# EAGLE design LD_v1 (EAGLE 7.1.0)
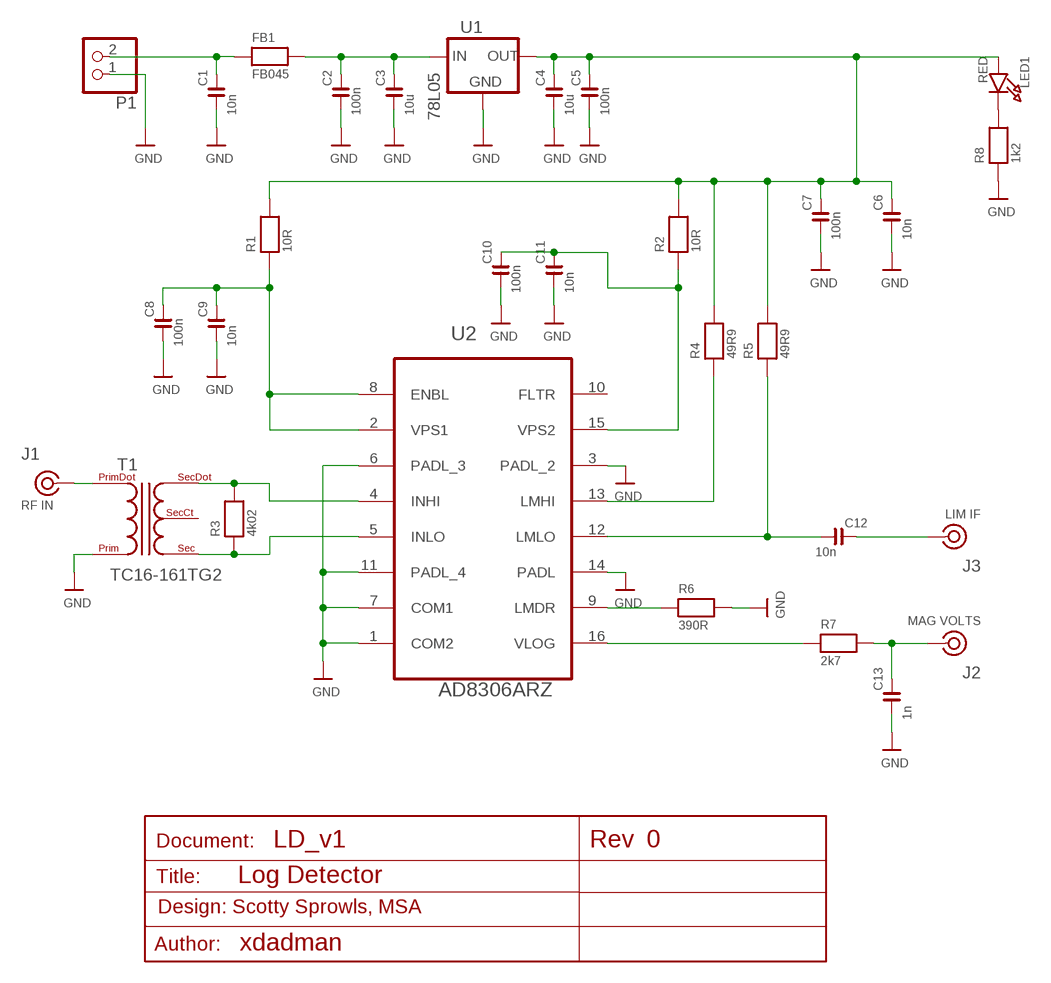
[diagram p0: schematic, sheet 1]

## Parts
C1  10n  C080510N  [C0805]
C2  100n  C0805100N  [C0805]
C3  10u  CC120610U  [C1206]
C4  10u  CC120610U  [C1206]
C5  100n  C0805100N  [C0805]
C6  10n  C080510N  [C0805]
C7  100n  C0805100N  [C0805]
C8  100n  C0805100N  [C0805]
C9  10n  C080510N  [C0805]
C10  100n  C0805100N  [C0805]
C11  10n  C080510N  [C0805]
C12  10n  C080510N  [C0805]
C13  1n  C08051N  [C0805]
FB1  FB045  R0805FB045  [R0805]
J1  RF IN  COAX  [SLIM_COAX_PAD]
J2  MAG VOLTS  COAX  [SLIM_COAX_PAD]
J3  LIM IF  COAX  [SLIM_COAX_PAD]
LED1  RED  LED_0603_RED0603  [CHIPLED_0603]
P1  PINHD-1X2  [1X02]
R1  10R  R080510R  [R0805]
R2  10R  R080510R  [R0805]
R3  4k02  R08054K02  [R0805]
R4  49R9  R080549R9  [R0805]
R5  49R9  R080549R9  [R0805]
R6  390R  R0805390R  [R0805]
R7  2k7  R08052K7  [R0805]
R8  1k2  R08051K2  [R0805]
T1  TC16-161TG2  [TC16-161TG2]
U1  78L05  78MXXL78L05  [SOT89]
U2  AD8306ARZ  [SOIC16]

## Nets
+5V: C4.2 C5.2 C6.2 C7.2 LED1.A R1.2 R2.2 R4.2 R5.2 U1.1(OUT)
+10V: C1.2 FB1.1 P1.2
GND: C1.1 C2.1 C3.1 C4.1 C5.1 C6.1 C7.1 C8.1 C9.1 C10.1 C11.1 C13.1 P1.1 R6.2 R8.1 T1.4 U1.2(GND) U1.4(GND) U2.1(COM2) U2.3(PADL_2) U2.6(PADL_3) U2.7(COM1) U2.11(PADL_4) U2.14(PADL)
N$1: C2.2 C3.2 FB1.2 U1.3(IN)
N$2: C8.2 C9.2 R1.1 U2.2(VPS1) U2.8(ENBL)
N$3: R4.1 U2.13(LMHI)
N$4: C13.2 J2.SIG R7.2
N$5: C12.1 R5.1 U2.12(LMLO)
N$6: C12.2 J3.SIG
N$7: R3.2 T1.1 U2.4(INHI)
N$8: R3.1 T1.3 U2.5(INLO)
N$9: J1.SIG T1.6
N$10: R6.1 U2.9(LMDR)
N$11: R7.1 U2.16(VLOG)
N$12: LED1.C R8.2
N$13: C10.2 C11.2 R2.1 U2.15(VPS2)
Unconnected: T1.2 U2.10(FLTR)

## Notes on the sheet
- 0
- Log Detector
- Design: Scotty Sprowls, MSA
- xdadman

## Power pins joined to a net without a drawn wire
GND: J1.GND J2.GND J3.GND

## Library data of the parts
C1 C6 C9 C11 C12 = MSA_lib:C0805: Ceramic capacitor; OC_FARNELL: 1414662
C2 C5 C7 C8 C10 = MSA_lib:C0805: Ceramic capacitor; OC_FARNELL: 1759166
C3 C4 = MSA_lib:CC1206: Capacitor ceramic 1206; OC_FARNELL: 1611967
C13 = MSA_lib:C0805: Ceramic capacitor; OC_FARNELL: 1833879
FB1 = MSA_lib:R0805: Resistors; OC_FARNELL: 1515661
J1-J3 = MSA_lib:COAX
LED1 = MSA_lib:LED_0603_RED: Chip LED 0603 RED 2ma; OC_FARNELL: 1685068
P1 = MSA_lib:PINHD-1X2: PIN HEADER
R1 R2 = MSA_lib:R0805: Resistors; OC_FARNELL: 2332043
R3 = MSA_lib:R0805: Resistors; OC_FARNELL: 2141823
R4 R5 = MSA_lib:R0805: Resistors; OC_FARNELL: 2312274
R6 = MSA_lib:R0805: Resistors; OC_FARNELL: 1500711
R7 = MSA_lib:R0805: Resistors; OC_FARNELL: 2332077
R8 = MSA_lib:R0805: Resistors; OC_FARNELL: 9333827
T1 = MSA_lib:TC16-161TG2: Minicirquits transformer; VENDOR: minicirquits
U1 = MSA_lib:78MXXL: VOLTAGE REGULATOR; OC_FARNELL: 1366573
U2 = MSA_lib:AD8306ARZ: High Precision Limiting-Logarithmic Amplifier; MPN: AD8306ARZ; OC_FARNELL: 1814350; OC_NEWARK: 59K6558; PACKAGE: SOIC-16; SUPPLIER: Analog Devices

## Board

Size 32 x 32 mm. Coordinates in mm from the lower left corner, seen from the top.
Outline: 0,0 32,0 32,32 0,32 0,0
Copper layers (1*16): Top 0.035mm / dielectric 1.5mm / Bottom 0.035mm
Design rules "kuba_no_CLR": minimum track width 8mil, minimum drill 15mil, track to track 8mil, track to pad 8mil, pad to pad 8mil, via to via 8mil, smd to smd 8mil, copper to edge 0mil, drill to drill 8mil, minimum pad ring 12mil, minimum via ring 10mil, stop-mask expansion 4mil, vias tented up to drill 0mil, thermal gap 10mil

### Footprints (pad centres in the part's own frame; a part is rotated, then mirrored left to right if it is on the bottom)
C0805 = smd 1.2 x 1.5: 1 -0.953,0; 2 0.953,0
C1206 = smd 1.6 x 1.8: 1 -1.4,0; 2 1.4,0
R0805 = smd 1.3 x 1.5: 1 -0.95,0; 2 0.95,0
SLIM_COAX_PAD = smd 1.27 x 0.635 bottom: GND 0,-2.667 | drill 1.1: SIG 0,0
CHIPLED_0603 = smd 0.8 x 0.8: A 0,-0.75; C 0,0.75
1X02 = drill 1.016: 1 -1.27,0; 2 1.27,0
TC16-161TG2 = smd 0.76 x 1.65: 1 -1.27,1.6; 2 0,1.6; 3 1.27,1.6; 4 1.27,-1.6; 6 -1.27,-1.6
SOT89 = smd 1.2 x 1.5: 1 -1.6,-2; 3 1.6,-2 | smd 1 x 1.5: 2 0,-2 | smd 2.4 x 3: 4 0,1.25
SOIC16 = smd 1.981 x 0.559: 1 -2.464,4.445; 2 -2.464,3.175; 3 -2.464,1.905; 4 -2.464,0.635; 5 -2.464,-0.635; 6 -2.464,-1.905; 7 -2.464,-3.175; 8 -2.464,-4.445; 9 2.464,-4.445; 10 2.464,-3.175; 11 2.464,-1.905; 12 2.464,-0.635; 13 2.464,0.635; 14 2.464,1.905; 15 2.464,3.175; 16 2.464,4.445

### Placement (x,y rotation side)
C1  4.32,4.83 90 top
C2  12.19,8.89 180 top
C3  9.91,5.08 90 top
C4  19.81,4.83 90 top
C5  17.27,4.32 90 top
C6  27.18,16.76 180 top
C7  27.18,14.48 180 top
C8  10.67,11.94 270 top
C9  10.67,20.07 270 top
C10  24.89,19.81 270 top
C11  22.61,19.81 270 top
C12  22.61,10.67 270 top
C13  22.61,23.62 90 top
FB1  5.08,8.64 0 top
J1  6.35,25.65 180 top
J2  25.4,25.65 180 top
J3  25.4,8.38 90 top
LED1  23.88,5.08 270 top
P1  7.11,4.83 90 top
R1  15.24,8.64 270 top
R2  17.53,8.64 270 top
R3  10.67,16 90 top
R4  23.37,16.76 0 top
R5  23.37,14.48 0 top
R6  19.81,9.4 270 top
R7  19.05,23.62 90 top
R8  26.16,4.06 90 top
T1  6.1,16 270 top
U1  13.72,4.83 180 top
U2  16.51,16 0 top

### Tracks (layer width: path | path; a pad name or v marks a point on that pad's centre or on a via)
+5V
  Top 0.406: LED1.A 23.13,6.21 23.11,6.23
  Top 0.61: R4.2 C6.2 C7.2 | R5.2 C7.2 | C4.2 23.11,6.23 26.67,6.23 26.67,6.35 27.94,7.62 27.94,11.68 26.67,12.95 26.67,14.03 C7.2
  Top 1.016: R1.2 15.24,6.9 U1.1 15.32,7.69 R2.2 17.53,6.6 | 17.53,6.6 17.53,5.52 C5.2 | C4.2 17.9,6.23 17.53,6.6
+10V
  Top 0.813: P1.2 4.32,6.1 C1.2 4.13,5.78 FB1.1
GND  (via drill 0.5)
  Top 0.305: C4.1 19.81,2.03 19.56,1.78 v17.91,1.78
  Top 0.61: U2.7 12.57,12.83 v12.45,12.95 12.38,12.89 C8.1 | T1.4 v3.05,14.73 | U2.1 12.57,20.45 v12.19,20.83 12,21.02 C9.1 | U2.3 12.83,17.91 v12.7,17.78 | U2.6 12.57,14.1 v12.45,14.22 | C13.1 22.61,22.61 v23.62,21.59 | C11.1 22.8,20.77 v23.62,21.59 | C10.1 24.45,20.77 v23.62,21.59 | U2.14 20.19,17.91 v20.32,18.03 | U2.11 20.19,14.1 v20.32,13.97 | R6.2 v19.81,8.38 19.81,8.13 | C1.1 4.32,1.78 7.11,1.78 | C7.1 28.13,15.68 v28.19,15.75 28.13,15.81 C6.1
  Top 0.813: C2.1 13.14,8.19 13.72,7.62 U1.2 U1.4 | C5.1 17.27,2.29 | C4.1 19.68,3.43 19.56,3.3
  Top 1.016: 7.11,1.78 P1.1 7.24,3.68 C3.1
  Top 1.626: 1.83,4.57 1.83,2.29
  Bottom 0.61: v12.45,12.95 12.19,12.95 | v3.05,14.73 2.03,14.73 | v12.19,20.83 11.94,20.83 | v12.7,17.78 12.19,17.78 | v12.45,14.22 12.45,13.72 | v23.62,21.59 23.62,21.34 | v20.32,18.03 20.32,17.53 20.57,17.27 | v20.32,13.97 20.32,14.22 20.57,14.48 | v19.81,8.38 20.32,8.38
  other vias: 1.78,2.03 1.78,5.59 1.78,9.4 1.78,13.72 1.78,18.03 1.78,22.35 1.78,26.67 1.78,30.23 5.59,30.23 9.91,30.23 13.97,30.23 18.03,30.23 21.84,30.23 25.91,30.23 30.23,30.23 30.23,26.67 30.23,22.61 30.23,19.3 29.97,12.7 29.97,9.14 29.97,5.84 29.97,1.78 26.16,1.78 22.35,1.78 13.72,7.37 13.72,4.57 13.72,1.78
  pour Top (no thermals): 0,0 32,0 32,32 0,32 0,3.81 2.54,3.81 2.54,29.21 29.21,29.21 29.21,2.54 2.54,2.54 2.54,3.3 0,3.3
  pour Bottom: 0,0 32,0 32,32 0,32
  pour Top (no thermals): 0,4.32 0,2.79 2.54,2.79 2.54,4.32
N$1  (1 unrouted)
  Top 0.813: FB1.2 7.75,8.64 C3.2 11.77,6.48 U1.3 11.24,7.7 C2.2 | 9.91,6.6 11.18,6.6 11.18,8.38
N$2
  Top 0.61: 15.37,11.56 U2.8 11.24,11.56 C8.2 | 15.37,11.56 16,12.19 16,18.8 15.62,19.18 U2.2 10.73,19.18 C9.2 | 15.37,11.56 15.37,9.71 R1.1
N$3
  Top 0.61: U2.13 22.29,16.64 R4.1
N$4
  Top 0.61: R7.2 C13.2
  Top 1.016: C13.2 24.32,24.57 J2.SIG
N$5
  Top 0.61: U2.12 20.7,15.37 21.08,14.99 21.91,14.99 R5.1 22.61,14.29 C12.1
N$6
  Top 1.016: C12.2 24.07,9.72 J3.SIG
N$7
  Top 0.61: U2.4 10.98,16.64 R3.2 8.7,16.95 8.38,17.27 T1.1 7.11,17.27
N$8
  Top 0.61: U2.5 10.98,15.37 R3.1 10.6,14.99 9.4,14.99 9.14,14.73 T1.3
N$9
  Top 1.016: T1.6 4.5,23.8 J1.SIG
N$10
  Top 0.61: R6.1 19.81,11.18 19.56,11.43 19.1,11.43 U2.9
N$11
  Top 0.61: U2.16 18.97,22.6 R7.1
N$12
  Top 0.406: LED1.C 26.1,5.08 R8.2
N$13
  Top 0.61: R2.1 17.02,10.09 17.02,18.8 17.4,19.18 U2.15 22.29,19.18 C11.2 C10.2

### Text on the board
tPlace: J1-RF IN | J2-MAGVOLTS | R7 | C13 | Log | Detector | C9 | C10 | U2 | C11 | T1 | C6 | R4 | R3 | R5 | C7 | R2 | R6 | FB1 | C8 | R1 | C2 | P1 | C3 | C12 | C12 | C5 | J3-LIM IF | R8 | C1 | U1 | LED1 | C4